# Altium schematic sheet DigiPower.SchDoc
size A4; SheetNumber: 1; SheetTotal: 1
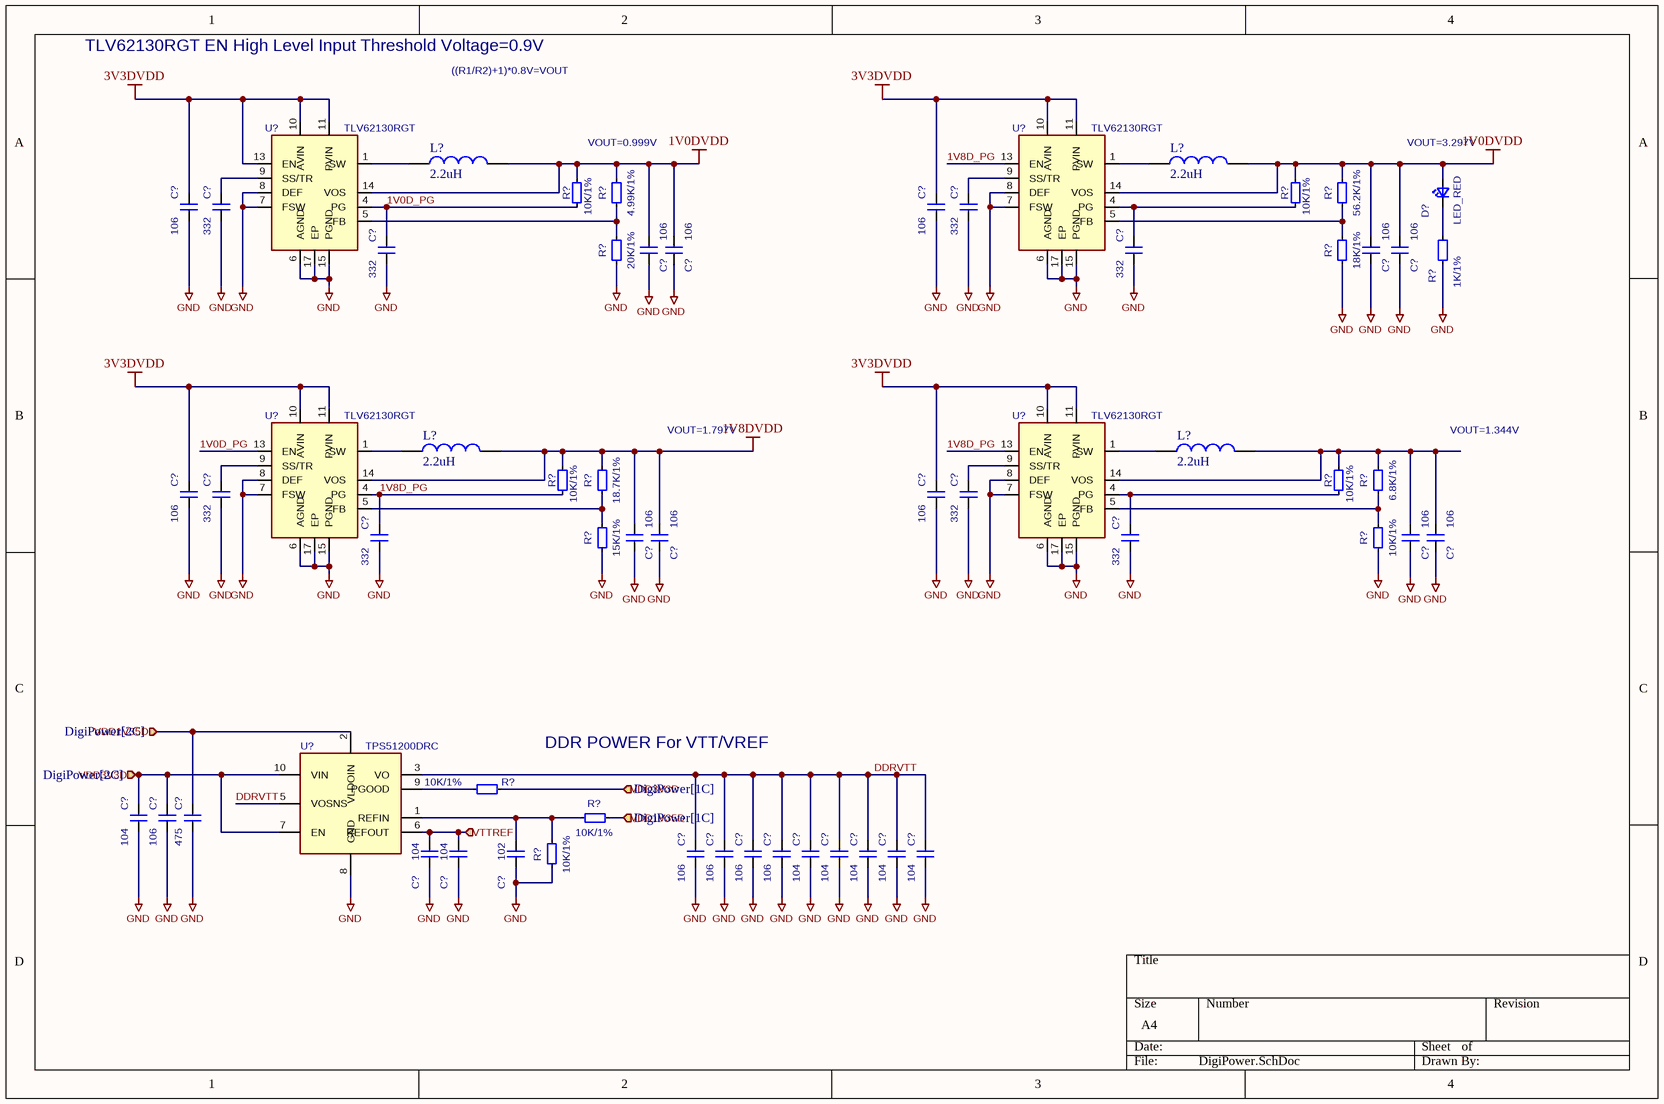
[diagram p0: DigiPower.SchDoc]

## Parts
(Parts that share a designator on the sheet are numbered #1, #2 ... from top to bottom, then left to right.)
C?#1  106  [C_0603_1608Metric]
C?#2  332  [C_0402_1005Metric]
C?#3  106  [C_0603_1608Metric]
C?#4  332  [C_0402_1005Metric]
C?#5  332  [C_0402_1005Metric]
C?#6  106  [C_0603_1608Metric]
C?#7  106  [C_0603_1608Metric]
C?#8  332  [C_0402_1005Metric]
C?#9  106  [C_0603_1608Metric]
C?#10  106  [C_0603_1608Metric]
C?#11  106  [C_0603_1608Metric]
C?#12  332  [C_0402_1005Metric]
C?#13  106  [C_0603_1608Metric]
C?#14  332  [C_0402_1005Metric]
C?#15  332  [C_0402_1005Metric]
C?#16  106  [C_0603_1608Metric]
C?#17  106  [C_0603_1608Metric]
C?#18  332  [C_0402_1005Metric]
C?#19  106  [C_0603_1608Metric]
C?#20  106  [C_0603_1608Metric]
C?#21  104  [C_0402_1005Metric]
C?#22  106  [C_0603_1608Metric]
C?#23  475  [C_0603_1608Metric]
C?#24  104  [C_0402_1005Metric]
C?#25  104  [C_0402_1005Metric]
C?#26  102  [C_0402_1005Metric]
C?#27  106  [C_0603_1608Metric]
C?#28  106  [C_0603_1608Metric]
C?#29  106  [C_0603_1608Metric]
C?#30  106  [C_0603_1608Metric]
C?#31  104  [C_0402_1005Metric]
C?#32  104  [C_0402_1005Metric]
C?#33  104  [C_0402_1005Metric]
C?#34  104  [C_0402_1005Metric]
C?#35  104  [C_0402_1005Metric]
D?  LED_RED  [LED_0402_1005Metric]
L?#1  2.2uH  [L 0805]
L?#2  2.2uH  [L 0805]
L?#3  2.2uH  [L 0805]
L?#4  2.2uH  [L 0805]
R?#1  10K/1%  [R_0402_1005Metric]
R?#2  4.99K/1%  [R_0402_1005Metric]
R?#3  10K/1%  [R_0402_1005Metric]
R?#4  56.2K/1%  [R_0402_1005Metric]
R?#5  20K/1%  [R_0402_1005Metric]
R?#6  18K/1%  [R_0402_1005Metric]
R?#7  1K/1%  [R_0402_1005Metric]
R?#8  10K/1%  [R_0402_1005Metric]
R?#9  18.7K/1%  [R_0402_1005Metric]
R?#10  10K/1%  [R_0402_1005Metric]
R?#11  6.8K/1%  [R_0402_1005Metric]
R?#12  15K/1%  [R_0402_1005Metric]
R?#13  10K/1%  [R_0402_1005Metric]
R?#14  10K/1%  [R_0402_1005Metric]
R?#15  10K/1%  [R_0402_1005Metric]
R?#16  10K/1%  [R_0402_1005Metric]
U?#1  TLV62130RGT  [VQFN-16-1EP_3x3mm_P0.5mm_EP1.68x1.68mm_ThermalVias]
U?#2  TLV62130RGT  [VQFN-16-1EP_3x3mm_P0.5mm_EP1.68x1.68mm_ThermalVias]
U?#3  TLV62130RGT  [VQFN-16-1EP_3x3mm_P0.5mm_EP1.68x1.68mm_ThermalVias]
U?#4  TLV62130RGT  [VQFN-16-1EP_3x3mm_P0.5mm_EP1.68x1.68mm_ThermalVias]
U?#5  TPS51200DRC  [VSON-10-1EP_3x3mm_P0.5mm_EP1.65x2.4mm]

## Ports
VDD1V35D (in, see DigiPower[1C]), VDD1V35D (in, see DigiPower[2C]), VDD3V3D (in, see DigiPower[1C]), VDD3V3D (in, see DigiPower[2C]), VTTREF (in)

## Nets
1V0DVDD: C?#6.2 C?#7.2 C?#9.2 C?#10.2 D?.2(A) L?#1.2 L?#2.2 R?#1.1 R?#2.1 R?#3.1 R?#4.1 U?#1.14(VOS) U?#2.14(VOS)
1V8DVDD: C?#16.2 C?#17.2 L?#3.2 R?#8.1 R?#9.1 U?#3.14(VOS)
3V3DVDD: C?#1.1 C?#3.1 C?#11.1 C?#13.1 U?#1.10(AVIN) U?#1.11(PVIN) U?#1.13(EN) U?#2.10(AVIN) U?#2.11(PVIN) U?#3.10(AVIN) U?#3.11(PVIN) U?#4.10(AVIN) U?#4.11(PVIN)
GND: C?#1.2 C?#2.2 C?#3.2 C?#4.2 C?#5.2 C?#6.1 C?#7.1 C?#8.2 C?#9.1 C?#10.1 C?#11.2 C?#12.2 C?#13.2 C?#14.2 C?#15.2 C?#16.1 C?#17.1 C?#18.2 C?#19.1 C?#20.1 C?#21.2 C?#22.2 C?#23.2 C?#24.2 C?#25.2 C?#26.2 C?#27.2 C?#28.2 C?#29.2 C?#30.2 C?#31.2 C?#32.2 C?#33.2 C?#34.2 C?#35.2 R?#5.2 R?#6.2 R?#7.2 R?#12.2 R?#13.2 R?#16.2 U?#1.6(AGND) U?#1.7(FSW) U?#1.8(DEF) U?#1.15(PGND) U?#1.17(EP) U?#2.6(AGND) U?#2.7(FSW) U?#2.8(DEF) U?#2.15(PGND) U?#2.17(EP) U?#3.6(AGND) U?#3.7(FSW) U?#3.8(DEF) U?#3.15(PGND) U?#3.17(EP) U?#4.6(AGND) U?#4.7(FSW) U?#4.8(DEF) U?#4.15(PGND) U?#4.17(EP) U?#5.8(GND)
1V0D_PG: C?#5.1 R?#1.2 U?#1.4(PG) U?#3.13(EN)
1V8D_PG: C?#15.1 R?#8.2 U?#2.13(EN) U?#3.4(PG) U?#4.13(EN)
DDRVTT: C?#27.1 C?#28.1 C?#29.1 C?#30.1 C?#31.1 C?#32.1 C?#33.1 C?#34.1 C?#35.1 U?#5.3(VO) U?#5.5(VOSNS)
VDD1V35D: C?#23.1 R?#15.1 U?#5.2(VLDOIN) ; port VDD1V35D
VDD3V3D: C?#21.1 C?#22.1 R?#14.1 U?#5.7(EN) U?#5.10(VIN) ; port VDD3V3D
VTTREF: C?#24.1 C?#25.1 U?#5.6(REFOUT) ; port VTTREF
NetC?#2_1: C?#2.1 U?#1.9(SS/TR)
NetC?#4_1: C?#4.1 U?#2.9(SS/TR)
NetC?#8_1: C?#8.1 R?#3.2 U?#2.4(PG)
NetC?#12_1: C?#12.1 U?#3.9(SS/TR)
NetC?#14_1: C?#14.1 U?#4.9(SS/TR)
NetC?#18_1: C?#18.1 R?#10.2 U?#4.4(PG)
NetC?#19_2: C?#19.2 C?#20.2 L?#4.2 R?#10.1 R?#11.1 U?#4.14(VOS)
NetC?#26_1: C?#26.1 R?#15.2 R?#16.1 U?#5.1(REFIN)
NetD?_1: D?.1(K) R?#7.1
NetL?#1_1: L?#1.1 U?#1.1(SW)
NetL?#2_1: L?#2.1 U?#2.1(SW)
NetL?#3_1: L?#3.1 U?#3.1(SW)
NetL?#4_1: L?#4.1 U?#4.1(SW)
NetR?#2_2: R?#2.2 R?#5.1 U?#1.5(FB)
NetR?#4_2: R?#4.2 R?#6.1 U?#2.5(FB)
NetR?#9_2: R?#9.2 R?#12.1 U?#3.5(FB)
NetR?#11_2: R?#11.2 R?#13.1 U?#4.5(FB)
NetR?#14_2: R?#14.2 U?#5.9(PGOOD)

Not connected (* = marked no-connect by the designer): U?#1 2(SW) 3(SW) 12(PVIN) 16(PGND); U?#2 2(SW) 3(SW) 12(PVIN) 16(PGND); U?#3 2(SW) 3(SW) 12(PVIN) 16(PGND); U?#4 2(SW) 3(SW) 12(PVIN) 16(PGND); U?#5 4(GND) 11(GND)

## Notes on the sheet
- TLV62130RGT EN High Level Input Threshold Voltage=0.9V
- ((R1/R2)+1)*0.8V=VOUT
- (near R?#2) VOUT=0.999V
- (near D?) VOUT=3.297V
- VOUT=1.797V
- VOUT=1.344V
- DDR POWER For VTT/VREF

## Library data of the parts
C?#1-C?#35 = C_Small
  C?#1 C?#3 C?#6 C?#7 C?#9-C?#11 C?#13 C?#16 C?#17 C?#19 C?#20 C?#22 C?#27-C?#30: Value: 106; Footprint: Core_ZYNQ:C_0603_1608Metric
  C?#2 C?#4 C?#5 C?#8 C?#12 C?#14 C?#15 C?#18: Value: 332; Footprint: Core_ZYNQ:C_0402_1005Metric
  C?#21 C?#24 C?#25 C?#31-C?#35: Value: 104; Footprint: Core_ZYNQ:C_0402_1005Metric
  C?#23: Value: 475; Footprint: Core_ZYNQ:C_0603_1608Metric
  C?#26: Value: 102; Footprint: Core_ZYNQ:C_0402_1005Metric
D? = LED_Small: Value: LED_RED; Footprint: LED_SMD:LED_0402_1005Metric
L?#1-L?#4 = L: 小功率贴片电感; 淘宝ID: 封装库来自淘宝 ID：黄晶宝石; 封装库来自淘宝卖家 ID：黄晶宝石: 其他店铺购入均为盗版，不享受售后技术支持服务，请立即申请退款; BOM名称: 小功率贴片电感; 联系售后: https://shop463601444.taobao.com
R?#1-R?#16 = R_Small: Footprint: Core_ZYNQ:R_0402_1005Metric
  R?#1 R?#3 R?#8 R?#10 R?#13-R?#16: Value: 10K/1%
  R?#2: Value: 4.99K/1%
  R?#4: Value: 56.2K/1%
  R?#5: Value: 20K/1%
  R?#6: Value: 18K/1%
  R?#7: Value: 1K/1%
  R?#9: Value: 18.7K/1%
  R?#11: Value: 6.8K/1%
  R?#12: Value: 15K/1%
U?#1-U?#4 = TLV62130RGT: Value: TLV62130RGT; Footprint: Core_ZYNQ:VQFN-16-1EP_3x3mm_P0.5mm_EP1.68x1.68mm_ThermalVias
U?#5 = TPS51200DRC: Value: TPS51200DRC; Footprint: Core_ZYNQ:VSON-10-1EP_3x3mm_P0.5mm_EP1.65x2.4mm